# Altium schematic sheet LCD&Camera&Connectors.SchDoc: LCD & Camera & Connector
size A4; DocumentNumber: MB1219; Revision: B.1; SheetNumber: 6; SheetTotal: 17; Project: STM32F769I-EVAL
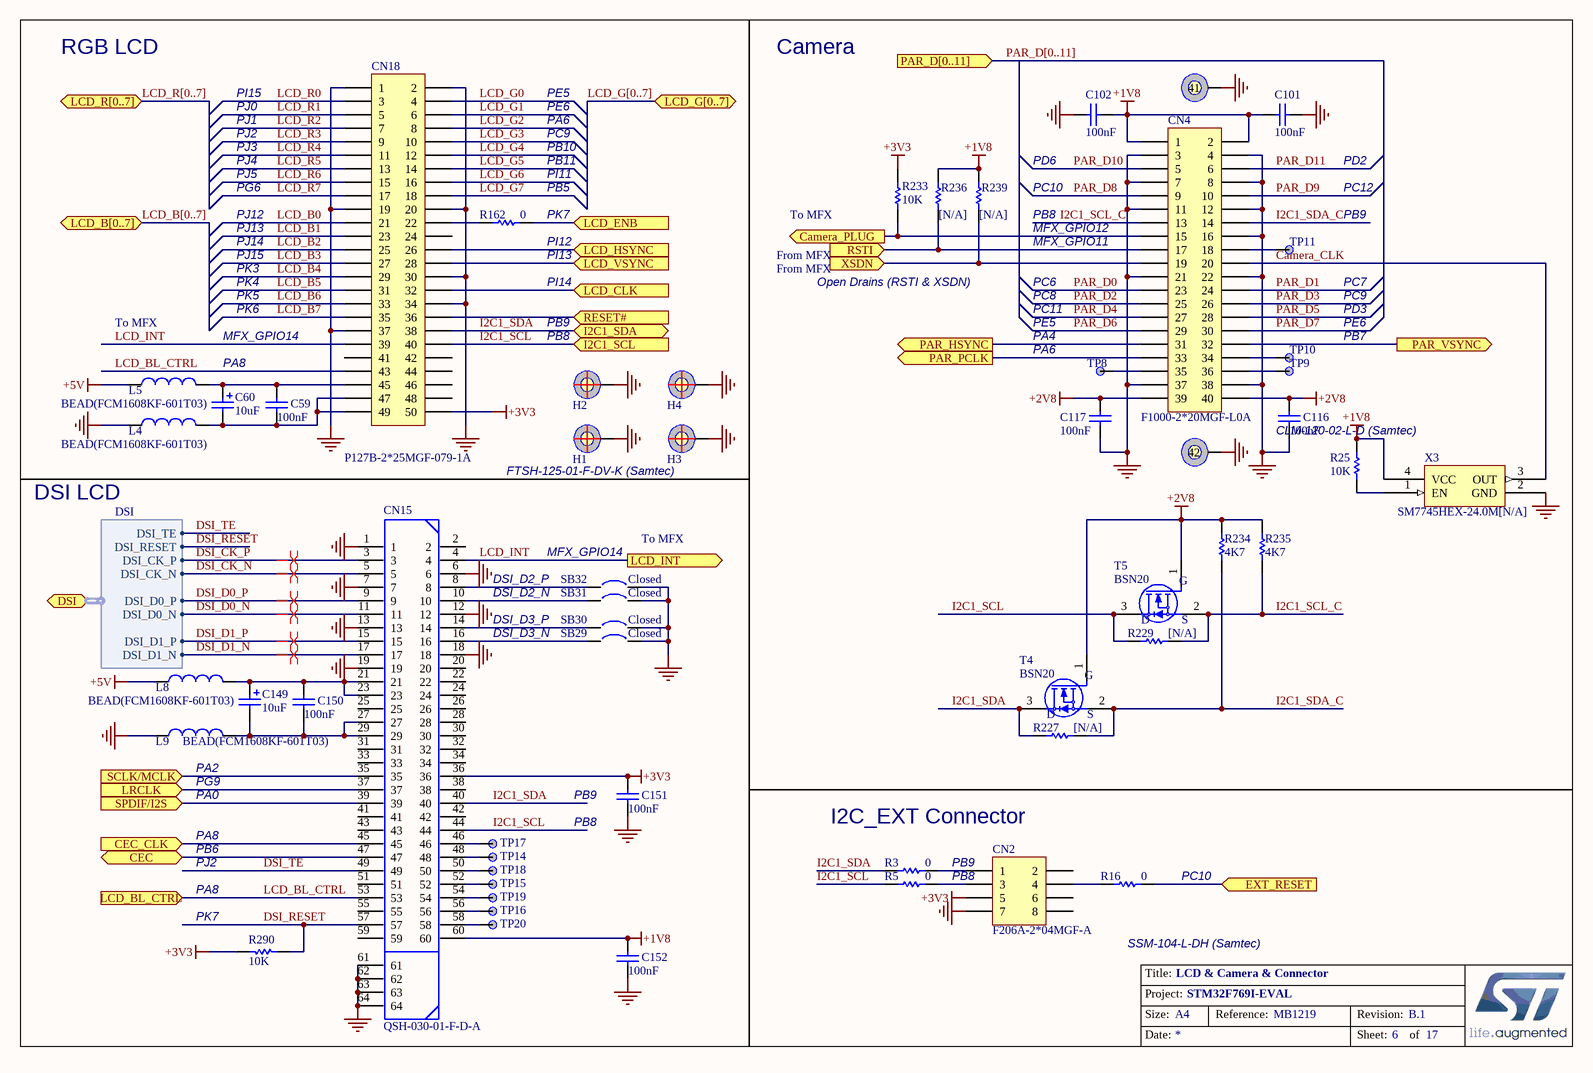
[diagram p0: LCD&Camera&Connectors.SchDoc]

## Parts
C59  100nF  [0603C]
C60  10uF  [TAN-A]
C101  100nF  [0603C]
C102  100nF  [0603C]
C116  100nF  [0603C]
C117  100nF  [0603C]
C149  10uF  [TAN-A]
C150  100nF  [0603C]
C151  100nF  [0603C]
C152  100nF  [0603C]
CN2  F206A-2*04MGF-A  [SSM-104-L-DH]
CN4  F1000-2*20MGF-L0A  [CLM-120-02-L-D]
CN15  QSH-030-01-F-D-A  [QSH-030-01-F-D-A]
CN18  P127B-2*25MGF-079-1A  [FTSH-125-01-F-DV]
H1  POSITION HOLE  [HOLE_C9D4R5]  (value not drawn)
H2  POSITION HOLE  [HOLE_C9D4R5]  (value not drawn)
H3  POSITION HOLE  [HOLE_C9D4R5]  (value not drawn)
H4  POSITION HOLE  [HOLE_C9D4R5]  (value not drawn)
L4  BEAD(FCM1608KF-601T03)  [0603L]
L5  BEAD(FCM1608KF-601T03)  [0603L]
L8  BEAD(FCM1608KF-601T03)  [0603L]
L9  BEAD(FCM1608KF-601T03)  [0603L]
R3  0  [0603R]
R5  0  [0603R]
R16  0  [0603R]
R25  10K  [0402R]
R162  0  [0603R]
R227  [N/A]  [0603R]
R229  [N/A]  [0603R]
R233  10K  [0603R]
R234  4K7  [0603R]
R235  4K7  [0603R]
R236  [N/A]  [0603R]
R239  [N/A]  [0603R]
R290  10K  [0603R]
SB29  Closed  [SB_0603]
SB30  Closed  [SB_0603]
SB31  Closed  [SB_0603]
SB32  Closed  [SB_0603]
T4  BSN20  [SOT-23]
T5  BSN20  [SOT-23]
TP8  (no value)  [TP]
TP9  (no value)  [TP]
TP10  (no value)  [TP]
TP11  (no value)  [TP]
TP14  (no value)  [TP]
TP15  (no value)  [TP]
TP16  (no value)  [TP]
TP17  (no value)  [TP]
TP18  (no value)  [TP]
TP19  (no value)  [TP]
TP20  (no value)  [TP]
X3  SM7745HEX-24.0M[N/A]  [OSC_4SM_7X5]

## Ports
Camera_PLUG (out), CEC (bidir), CEC_CLK (in), DSI (harness DSI), EXT_RESET (in), I2C1_SCL (in), I2C1_SDA (bidir), LCD_B[0..7] (bidir), LCD_BL_CTRL (in), LCD_CLK (in), LCD_ENB (in), LCD_G[0..7] (bidir), LCD_HSYNC (in), LCD_INT (out), LCD_R[0..7] (bidir), LCD_VSYNC (in), LRCLK (in), PAR_D[0..11] (in), PAR_HSYNC (out), PAR_PCLK (out), PAR_VSYNC (out), RESET# (in), RSTI (in), SCLK/MCLK (in), SPDIF/I2S (in), XSDN (in)

## Harnesses
DSI: DSI_CK_P, DSI_CK_N, DSI_D0_P, DSI_D0_N, DSI_D1_P, DSI_D1_N, DSI_TE, DSI_RESET

## Nets
+1V8: C101.1 C102.2 C152.1 CN4.1 CN4.2 CN15.60 R25.2 R236.2 R239.2 X3.4(VCC)
+2V8: C116.1 C117.1 CN4.39 CN4.40 R234.2 R235.2 T4.1(G) T5.1(G)
+3V3: C151.1 CN2.5 CN15.36 CN18.50 R233.1 R290.2
+5V: L5.1 L8.1
GND: C101.2 C102.1 C116.2 C117.2 C151.2 C152.2 CN2.7 CN4.3 CN4.4 CN4.7 CN4.8 CN4.11 CN4.12 CN4.16 CN4.21 CN4.22 CN4.37 CN4.38 CN4.41 CN4.42 CN15.1 CN15.6 CN15.7 CN15.12 CN15.13 CN15.18 CN15.19 CN15.61 CN15.62 CN15.63 CN15.64 CN18.1 CN18.2 CN18.19 CN18.20 CN18.30 CN18.34 CN18.37 H1.1 H2.1 H3.1 H4.1 L4.1 L9.1 SB29.2 SB30.2 SB31.2 SB32.2 X3.2(GND)
Camera_CLK: CN4.20 X3.3(OUT)
Camera_PLUG: CN4.15 R233.2 ; port Camera_PLUG
CEC: CN15.47 ; port CEC
CEC_CLK: CN15.45 ; port CEC_CLK
DSI_CK_N: CN15.5 ; port DSI.DSI_CK_N
DSI_CK_P: CN15.3 ; port DSI.DSI_CK_P
DSI_D0_N: CN15.11 ; port DSI.DSI_D0_N
DSI_D0_P: CN15.9 ; port DSI.DSI_D0_P
DSI_D1_N: CN15.17 ; port DSI.DSI_D1_N
DSI_D1_P: CN15.15 ; port DSI.DSI_D1_P
DSI_RESET: CN15.57 R290.1 ; port DSI.DSI_RESET
DSI_TE: CN15.49 ; port DSI.DSI_TE
EXT_RESET: R16.2 ; port EXT_RESET
I2C1_SCL: CN15.44 CN18.40 R5.1 R229.1 T5.3(D) ; port I2C1_SCL
I2C1_SCL_C: CN4.13 R229.2 R235.1 T5.2(S)
I2C1_SDA: CN15.40 CN18.38 R3.1 R227.1 T4.3(D) ; port I2C1_SDA
I2C1_SDA_C: CN4.14 R227.2 R234.1 T4.2(S)
LCD_B0: CN18.21
LCD_B1: CN18.23
LCD_B2: CN18.25
LCD_B3: CN18.27
LCD_B4: CN18.29
LCD_B5: CN18.31
LCD_B6: CN18.33
LCD_B7: CN18.35
LCD_BL_CTRL: CN15.53 CN18.43 ; port LCD_BL_CTRL
LCD_CLK: CN18.32 ; port LCD_CLK
LCD_ENB: R162.2 ; port LCD_ENB
LCD_G0: CN18.4
LCD_G1: CN18.6
LCD_G2: CN18.8
LCD_G3: CN18.10
LCD_G4: CN18.12
LCD_G5: CN18.14
LCD_G6: CN18.16
LCD_G7: CN18.18
LCD_HSYNC: CN18.26 ; port LCD_HSYNC
LCD_INT: CN15.4 CN18.39 ; port LCD_INT
LCD_R0: CN18.3
LCD_R1: CN18.5
LCD_R2: CN18.7
LCD_R3: CN18.9
LCD_R4: CN18.11
LCD_R5: CN18.13
LCD_R6: CN18.15
LCD_R7: CN18.17
LCD_VSYNC: CN18.28 ; port LCD_VSYNC
LRCLK: CN15.37 ; port LRCLK
PAR_D0: CN4.23
PAR_D1: CN4.24
PAR_D2: CN4.25
PAR_D3: CN4.26
PAR_D4: CN4.27
PAR_D5: CN4.28
PAR_D6: CN4.29
PAR_D7: CN4.30
PAR_D8: CN4.9
PAR_D9: CN4.10
PAR_D10: CN4.5
PAR_D11: CN4.6
PAR_HSYNC: CN4.31 ; port PAR_HSYNC
PAR_PCLK: CN4.33 ; port PAR_PCLK
PAR_VSYNC: CN4.32 ; port PAR_VSYNC
RESET#: CN18.36 ; port RESET#
RSTI: CN4.17 R236.1 ; port RSTI
SCLK/MCLK: CN15.35 ; port SCLK/MCLK
SPDIF/I2S: CN15.39 ; port SPDIF/I2S
XSDN: CN4.19 R239.1 ; port XSDN
NetC59_1: C59.1 C60.1 CN18.45 L5.2
NetC59_2: C59.2 C60.2 CN18.47 CN18.49 L4.2
NetC149_1: C149.1 C150.1 CN15.21 CN15.23 L8.2
NetC149_2: C149.2 C150.2 CN15.27 CN15.29 L9.2
NetCN2_1: CN2.1 R3.2
NetCN2_3: CN2.3 R5.2
NetCN2_4: CN2.4 R16.1
NetCN4_18: CN4.18 TP11.1
NetCN4_34: CN4.34 TP10.1
NetCN4_35: CN4.35 TP8.1
NetCN4_36: CN4.36 TP9.1
NetCN15_8: CN15.8 SB32.1
NetCN15_10: CN15.10 SB31.1
NetCN15_14: CN15.14 SB30.1
NetCN15_16: CN15.16 SB29.1
NetCN15_46: CN15.46 TP17.1
NetCN15_48: CN15.48 TP14.1
NetCN15_50: CN15.50 TP18.1
NetCN15_52: CN15.52 TP15.1
NetCN15_54: CN15.54 TP19.1
NetCN15_56: CN15.56 TP16.1
NetCN15_58: CN15.58 TP20.1
NetCN18_22: CN18.22 R162.1
NetR25_1: R25.1 X3.1(EN)

Not connected (* = marked no-connect by the designer): CN2 2 6 8; CN15 2 20 22 24 25 26 28 30 31 32 33 34 38 41 42 43 51 55 59; CN18 24 41 42 44 46 48

## Buses and harness runs
bus LCD_B[0..7] = port LCD_B[0..7]
bus LCD_G[0..7] = port LCD_G[0..7]
bus LCD_R[0..7] = port LCD_R[0..7]
bus PAR_D[0..11] = port PAR_D[0..11]

## Layout directives
differential pair: DSI_CK_N, DSI_CK_P, DSI_D0_N, DSI_D0_P, DSI_D1_N, DSI_D1_P

## Notes on the sheet
- RGB LCD
- Camera
- PI15
- PJ0
- PJ1
- PE5
- PE6
- PA6
- PJ2
- PJ3
- PJ4
- PJ5
- PG6
- PC9
- PB10
- PB11
- (near R162) PI11
- (near R162) PB5
- PC10
- PD6
- PD2
- PC12
- PJ12
- PJ13
- PJ14
- PJ15
- (near R162) PK7
- (near R162) PI12
- (near R162) PI13
- From MFX
- To MFX
- PB8
- MFX_GPIO12
- MFX_GPIO11
- PB9
- PK3
- PK4
- PK5
- PK6
- PI14
- Open Drains (RSTI & XSDN)
- PC11
- PC6
- PC8
- PC7
- PD3
- PA8
- MFX_GPIO14
- PA4
- PB7
- (near CN4) CLM-120-02-L-D (Samtec)
- DSI LCD
- FTSH-125-01-F-DV-K (Samtec)
- DSI_D2_P
- DSI_D2_N
- DSI_D3_P
- DSI_D3_N
- PA0
- (near L9) PA2
- (near L9) PG9
- (near C151) PB9
- PB6
- (near C151) PB8
- I2C_EXT Connector
- (near R290) PK7
- (near R16) PC10
- (near CN2) SSM-104-L-DH (Samtec)
- Title:
- Project:
- Size:
- Date:
- A4
- Reference:
- Sheet:
- Revision:
- of

## Library data of the parts
C59 C101 C102 C116 C117 C150-C152 = Cap: Capacitor; Value: 10nF; Published: 8-Jun-2000; Revision: July-2002: Re-released for DXP Platform.; Publisher: Altium Limited
C60 C149 = Cap Pol1: Polarized Capacitor (Radial); Published: 8-Jun-2000; Revision: July-2002: Re-released for DXP Platform.; Publisher: Altium Limited; Value: 10uF
CN2 = SSM-104-L-DH: Header, 5-Pin, Dual row; Revision: 17-Jul-2002: Re-released for DXP Platform.; Publisher: Altium Limited
CN4 = CLM-120-02-L-D: Header, 20-Pin, Dual row; Revision: 17-Jul-2002: Re-released for DXP Platform.; Publisher: Altium Limited
CN15 = QSH-030-01-F-D-A: HIGH SPEED SOCKET STRIP, .5mm PITCH, 60 PINS; MANUFACTURER: SAMTEC; PCB DECAL: QSH-030-01-X-D-A; CREATED: 28 JAN 2014 - WENDY XIN
CN18 = Header 25X2: Header, 26-Pin, Dual row; Revision: 17-Jul-2002: Re-released for DXP Platform.; Publisher: Altium Limited
L4 L5 L8 L9 = Inductor: Value: 100uH; Published: 8-Jun-2000; Revision: July-2002: Re-released for DXP Platform.; Publisher: Altium Limited
R3 R5 R16 R25 R162 R227 R229 R233 R290 = Res1: Resistor; Value: 1K; Published: 8-Jun-2000; Revision: July-2002: Re-released for DXP Platform.; Publisher: Altium Limited
R234-R236 R239 = res1: Resistor; Value: 1K; Published: 8-Jun-2000; Revision: July-2002: Re-released for DXP Platform.; Publisher: Altium Limited
SB29-SB32 = Circuit Breaker: Published: 24-Mar-1999; Revision: July-2002: Re-released for DXP Platform.; Publisher: Altium Limited
T4 T5 = 2N7000
TP8-TP11 TP14-TP20 = TP
X3 = SM7745HEV-50.0M